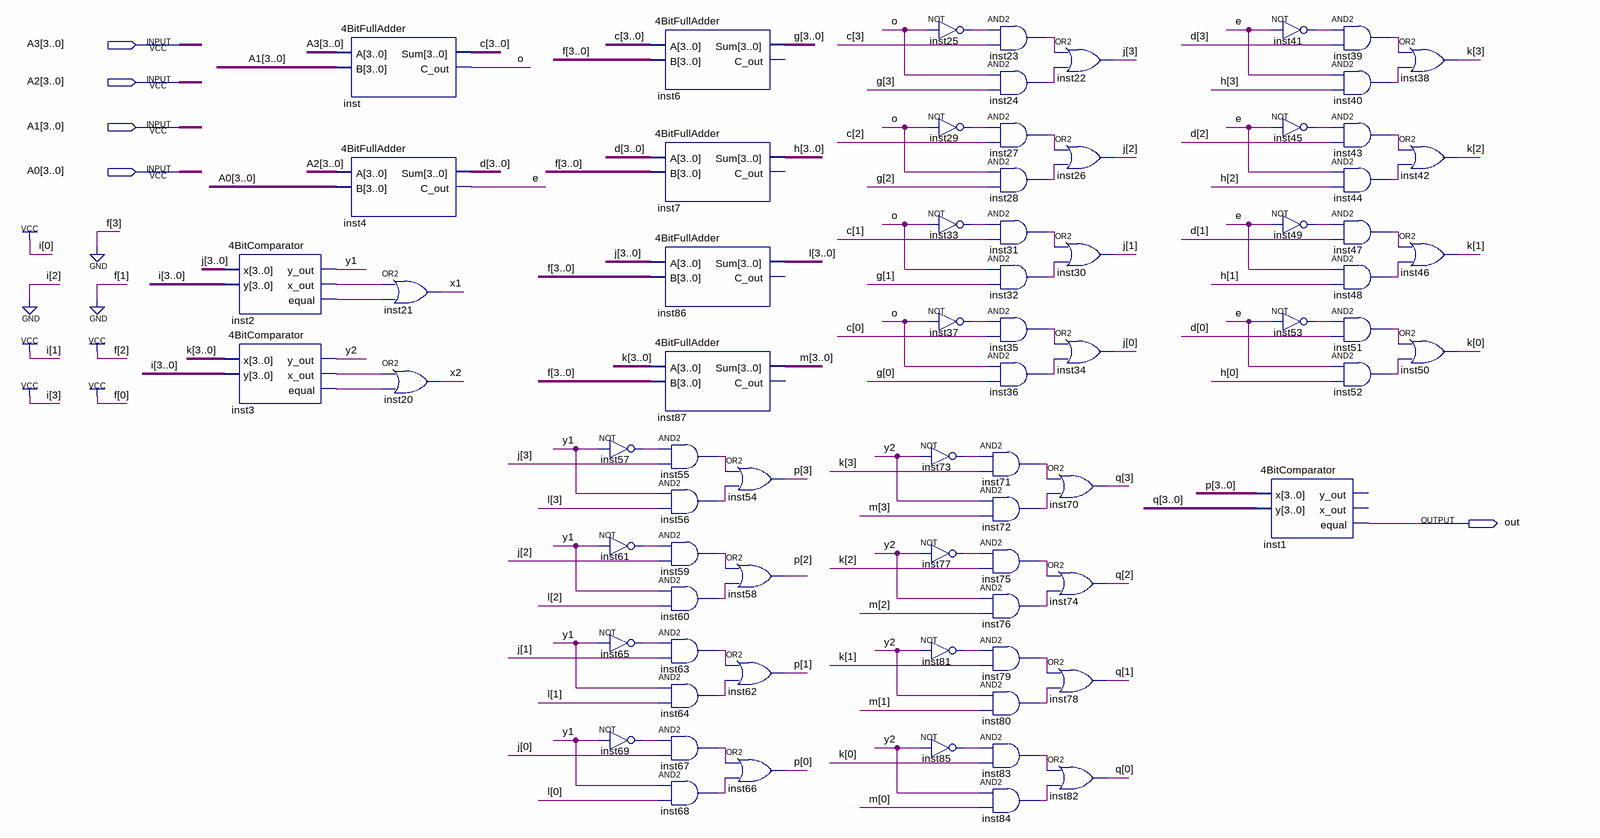
[diagram p0: schematic sheet]
// Quartus schematic 11divide.bdf as structural Verilog: 75 symbols, 5 pins
module \11divide  (
  input  [3:0] A3,
  input  [3:0] A2,
  input  [3:0] A1,
  input  [3:0] A0,
  output out
);

  wire e, inst2_equal, inst2_x_out, inst3_equal, inst3_x_out, inst23_out, inst24_out, inst25_out, inst27_out,
       inst28_out, inst29_out, inst31_out, inst32_out, inst33_out, inst35_out, inst36_out, inst37_out,
       inst39_out, inst40_out, inst41_out, inst43_out, inst44_out, inst45_out, inst47_out, inst48_out,
       inst49_out, inst51_out, inst52_out, inst53_out, inst55_out, inst56_out, inst57_out, inst59_out,
       inst60_out, inst61_out, inst63_out, inst64_out, inst65_out, inst67_out, inst68_out, inst69_out,
       inst71_out, inst72_out, inst73_out, inst75_out, inst76_out, inst77_out, inst79_out, inst80_out,
       inst81_out, inst83_out, inst84_out, inst85_out, o, x1, x2, y1, y2;
  wire [3:0] c, d, g, h, j, k, l, m, p, q;

  \4BitComparator  inst2 (.x(j), .y(4'b1011), .y_out(y1), .x_out(inst2_x_out), .equal(inst2_equal));
  \4BitComparator  inst3 (.x(k), .y(4'b1011), .y_out(y2), .x_out(inst3_x_out), .equal(inst3_equal));
  \4BitFullAdder  inst (.A(A3), .B(A1), .Sum(c), .C_out(o));
  \4BitFullAdder  inst4 (.A(A2), .B(A0), .Sum(d), .C_out(e));
  or inst21 (x1, inst2_x_out, inst2_equal);
  or inst20 (x2, inst3_x_out, inst3_equal);
  not inst57 (inst57_out, y1);
  not inst61 (inst61_out, y1);
  not inst65 (inst65_out, y1);
  not inst69 (inst69_out, y1);
  \4BitFullAdder  inst6 (.A(c), .B(4'b0101), .Sum(g));  // open: C_out
  \4BitFullAdder  inst7 (.A(d), .B(4'b0101), .Sum(h));  // open: C_out
  \4BitFullAdder  inst86 (.A(j), .B(4'b0101), .Sum(l));  // open: C_out
  \4BitFullAdder  inst87 (.A(k), .B(4'b0101), .Sum(m));  // open: C_out
  and inst55 (inst55_out, inst57_out, j[3]);
  and inst56 (inst56_out, y1, l[3]);
  and inst59 (inst59_out, inst61_out, j[2]);
  and inst60 (inst60_out, y1, l[2]);
  and inst63 (inst63_out, inst65_out, j[1]);
  and inst64 (inst64_out, y1, l[1]);
  and inst67 (inst67_out, inst69_out, j[0]);
  and inst68 (inst68_out, y1, l[0]);
  or inst54 (p[3], inst55_out, inst56_out);
  or inst58 (p[2], inst59_out, inst60_out);
  or inst62 (p[1], inst63_out, inst64_out);
  or inst66 (p[0], inst67_out, inst68_out);
  not inst25 (inst25_out, o);
  not inst29 (inst29_out, o);
  not inst33 (inst33_out, o);
  not inst37 (inst37_out, o);
  not inst73 (inst73_out, y2);
  not inst77 (inst77_out, y2);
  not inst81 (inst81_out, y2);
  not inst85 (inst85_out, y2);
  and inst23 (inst23_out, inst25_out, c[3]);
  and inst24 (inst24_out, o, g[3]);
  and inst27 (inst27_out, inst29_out, c[2]);
  and inst28 (inst28_out, o, g[2]);
  and inst31 (inst31_out, inst33_out, c[1]);
  and inst32 (inst32_out, o, g[1]);
  and inst35 (inst35_out, inst37_out, c[0]);
  and inst36 (inst36_out, o, g[0]);
  and inst71 (inst71_out, inst73_out, k[3]);
  and inst72 (inst72_out, y2, m[3]);
  and inst75 (inst75_out, inst77_out, k[2]);
  and inst76 (inst76_out, y2, m[2]);
  and inst79 (inst79_out, inst81_out, k[1]);
  and inst80 (inst80_out, y2, m[1]);
  and inst83 (inst83_out, inst85_out, k[0]);
  and inst84 (inst84_out, y2, m[0]);
  or inst22 (j[3], inst23_out, inst24_out);
  or inst26 (j[2], inst27_out, inst28_out);
  or inst30 (j[1], inst31_out, inst32_out);
  or inst34 (j[0], inst35_out, inst36_out);
  or inst70 (q[3], inst71_out, inst72_out);
  or inst74 (q[2], inst75_out, inst76_out);
  or inst78 (q[1], inst79_out, inst80_out);
  or inst82 (q[0], inst83_out, inst84_out);
  not inst41 (inst41_out, e);
  not inst45 (inst45_out, e);
  not inst49 (inst49_out, e);
  not inst53 (inst53_out, e);
  \4BitComparator  inst1 (.x(p), .y(q), .equal(out));  // open: y_out, x_out
  and inst39 (inst39_out, inst41_out, d[3]);
  and inst40 (inst40_out, e, h[3]);
  and inst43 (inst43_out, inst45_out, d[2]);
  and inst44 (inst44_out, e, h[2]);
  and inst47 (inst47_out, inst49_out, d[1]);
  and inst48 (inst48_out, e, h[1]);
  and inst51 (inst51_out, inst53_out, d[0]);
  and inst52 (inst52_out, e, h[0]);
  or inst38 (k[3], inst39_out, inst40_out);
  or inst42 (k[2], inst43_out, inst44_out);
  or inst46 (k[1], inst47_out, inst48_out);
  or inst50 (k[0], inst51_out, inst52_out);
endmodule
